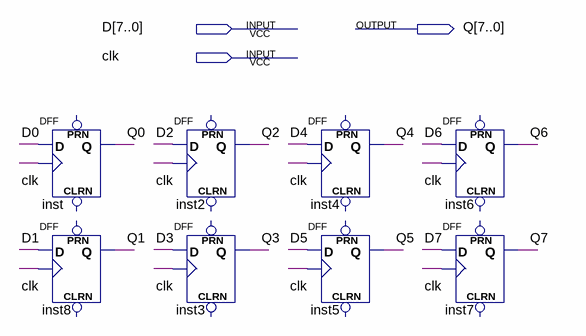
[diagram p0: schematic sheet]
// Quartus schematic DFF8.bdf as structural Verilog: 8 symbols, 3 pins
module DFF8 (
  input  [7:0] D,
  input  clk,
  output [7:0] Q
);

  DFF inst (.CLK(clk), .D(D[0]), .Q(Q[0]));  // open: CLRN, PRN
  DFF inst8 (.CLK(clk), .D(D[1]), .Q(Q[1]));  // open: CLRN, PRN
  DFF inst2 (.CLK(clk), .D(D[2]), .Q(Q[2]));  // open: CLRN, PRN
  DFF inst3 (.CLK(clk), .D(D[3]), .Q(Q[3]));  // open: CLRN, PRN
  DFF inst4 (.CLK(clk), .D(D[4]), .Q(Q[4]));  // open: CLRN, PRN
  DFF inst5 (.CLK(clk), .D(D[5]), .Q(Q[5]));  // open: CLRN, PRN
  DFF inst6 (.CLK(clk), .D(D[6]), .Q(Q[6]));  // open: CLRN, PRN
  DFF inst7 (.CLK(clk), .D(D[7]), .Q(Q[7]));  // open: CLRN, PRN
endmodule
